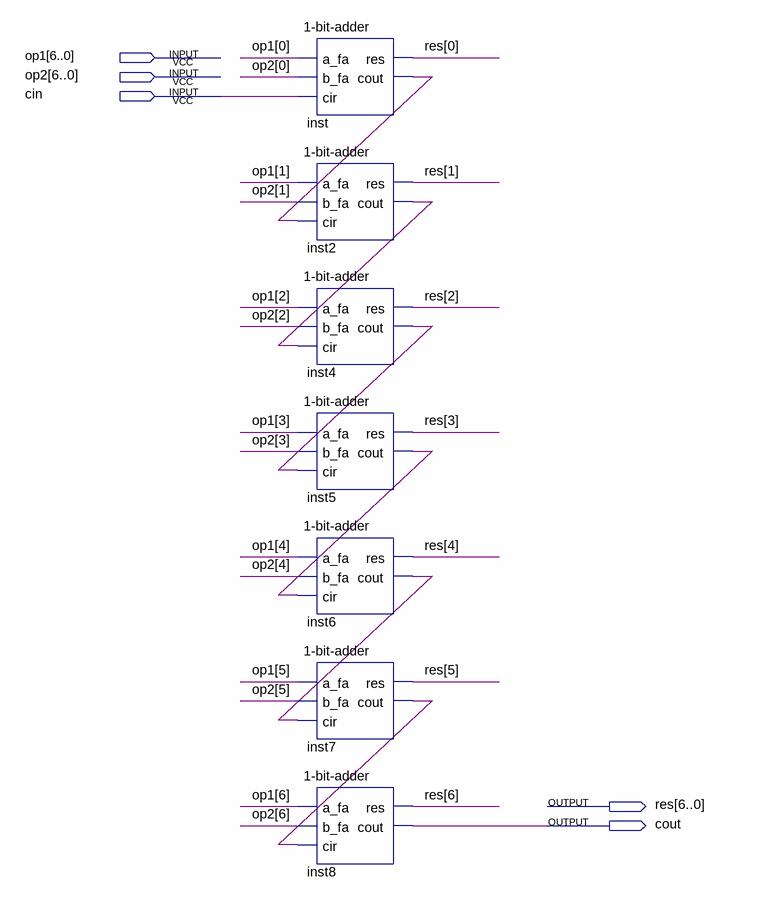
[diagram p0: schematic sheet]
// Quartus schematic full_adder_unsigned_7bit.bdf as structural Verilog: 7 symbols, 5 pins
module full_adder_unsigned_7bit (
  input  [6:0] op1,
  input  [6:0] op2,
  input  cin,
  output [6:0] res,
  output cout
);

  wire inst2_cout, inst4_cout, inst5_cout, inst6_cout, inst7_cout, inst_cout;

  \1-bit-adder  inst (.a_fa(op1[0]), .b_fa(op2[0]), .cir(cin), .res(res[0]), .cout(inst_cout));
  \1-bit-adder  inst2 (.a_fa(op1[1]), .b_fa(op2[1]), .cir(inst_cout), .res(res[1]), .cout(inst2_cout));
  \1-bit-adder  inst4 (.a_fa(op1[2]), .b_fa(op2[2]), .cir(inst2_cout), .res(res[2]), .cout(inst4_cout));
  \1-bit-adder  inst5 (.a_fa(op1[3]), .b_fa(op2[3]), .cir(inst4_cout), .res(res[3]), .cout(inst5_cout));
  \1-bit-adder  inst6 (.a_fa(op1[4]), .b_fa(op2[4]), .cir(inst5_cout), .res(res[4]), .cout(inst6_cout));
  \1-bit-adder  inst7 (.a_fa(op1[5]), .b_fa(op2[5]), .cir(inst6_cout), .res(res[5]), .cout(inst7_cout));
  \1-bit-adder  inst8 (.a_fa(op1[6]), .b_fa(op2[6]), .cir(inst7_cout), .res(res[6]), .cout(cout));
endmodule
